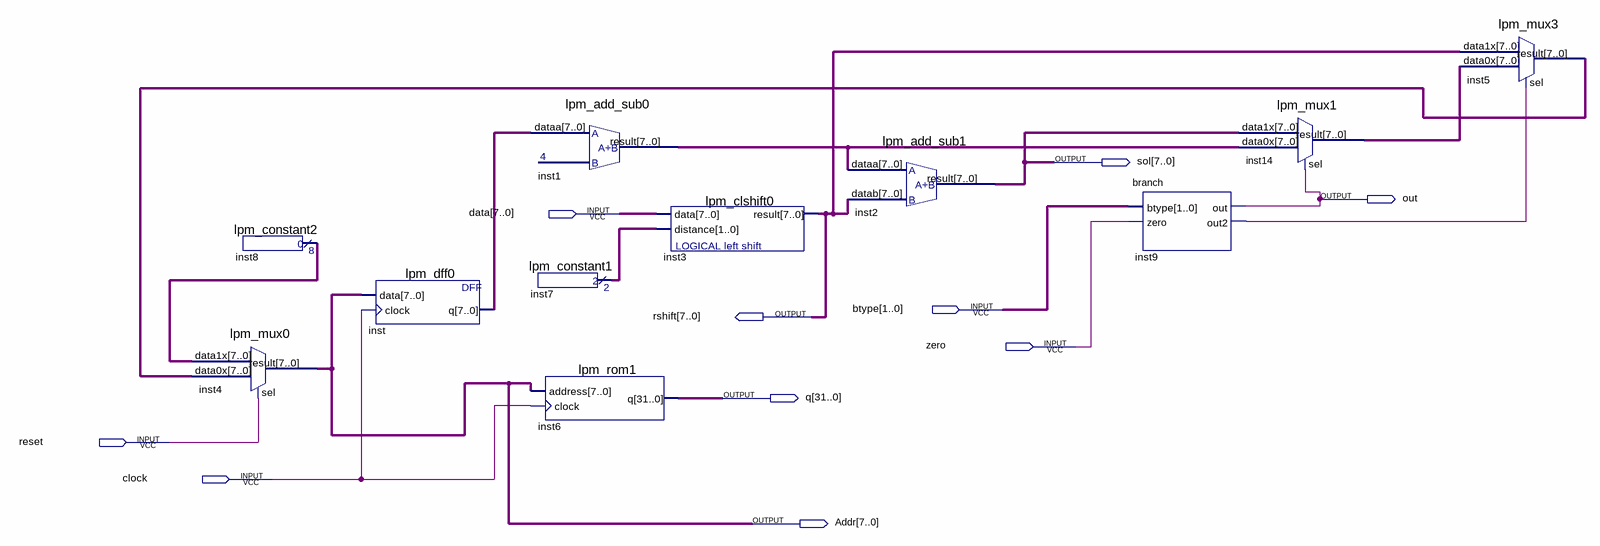
[diagram p0: schematic sheet]
// Quartus schematic fetch.bdf as structural Verilog: 11 symbols, 10 pins
module fetch (
  input  [7:0] data,
  input  [1:0] btype,
  input  zero,
  input  reset,
  input  clock,
  output [7:0] sol,
  output out,
  output [7:0] rshift,
  output [31:0] q,
  output [7:0] Addr
);

  wire inst9_out2;
  wire [1:0] inst7_result;
  wire [7:0] inst1_result, inst5_result, inst8_result, inst14_result, inst_q;

  lpm_mux0 inst4 (.data1x(inst8_result), .data0x(inst5_result), .sel(reset), .result(Addr));
  lpm_constant2 inst8 (.result(inst8_result));
  lpm_dff0 inst (.data(Addr), .clock(clock), .q(inst_q));
  lpm_add_sub0 inst1 (.dataa(inst_q), .result(inst1_result));
  lpm_constant1 inst7 (.result(inst7_result));
  lpm_rom1 inst6 (.address(Addr), .clock(clock), .q(q));
  lpm_clshift0 inst3 (.data(data), .distance(inst7_result), .result(rshift));
  lpm_add_sub1 inst2 (.dataa(inst1_result), .datab(rshift), .result(sol));
  branch inst9 (.btype(btype), .zero(zero), .out(out), .out2(inst9_out2));
  lpm_mux1 inst14 (.data1x(sol), .data0x(inst1_result), .sel(out), .result(inst14_result));
  lpm_mux3 inst5 (.data1x(rshift), .data0x(inst14_result), .sel(inst9_out2), .result(inst5_result));
endmodule
